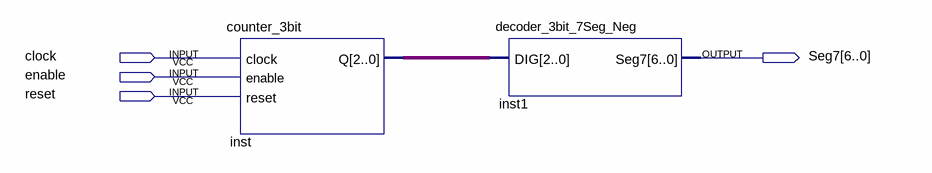
[diagram p0: schematic sheet]
// Quartus schematic counter_decoder_7Seg_3bit.bdf as structural Verilog: 2 symbols, 4 pins
module counter_decoder_7Seg_3bit (
  input  clock,
  input  enable,
  input  reset,
  output [6:0] Seg7
);

  wire [2:0] inst_q;

  counter_3bit inst (.clock(clock), .enable(enable), .reset(reset), .Q(inst_q));
  decoder_3bit_7Seg_Neg inst1 (.DIG(inst_q), .Seg7(Seg7));
endmodule
